# Altium schematic sheet Sh_Outputs_Analog.SchDoc
size A4
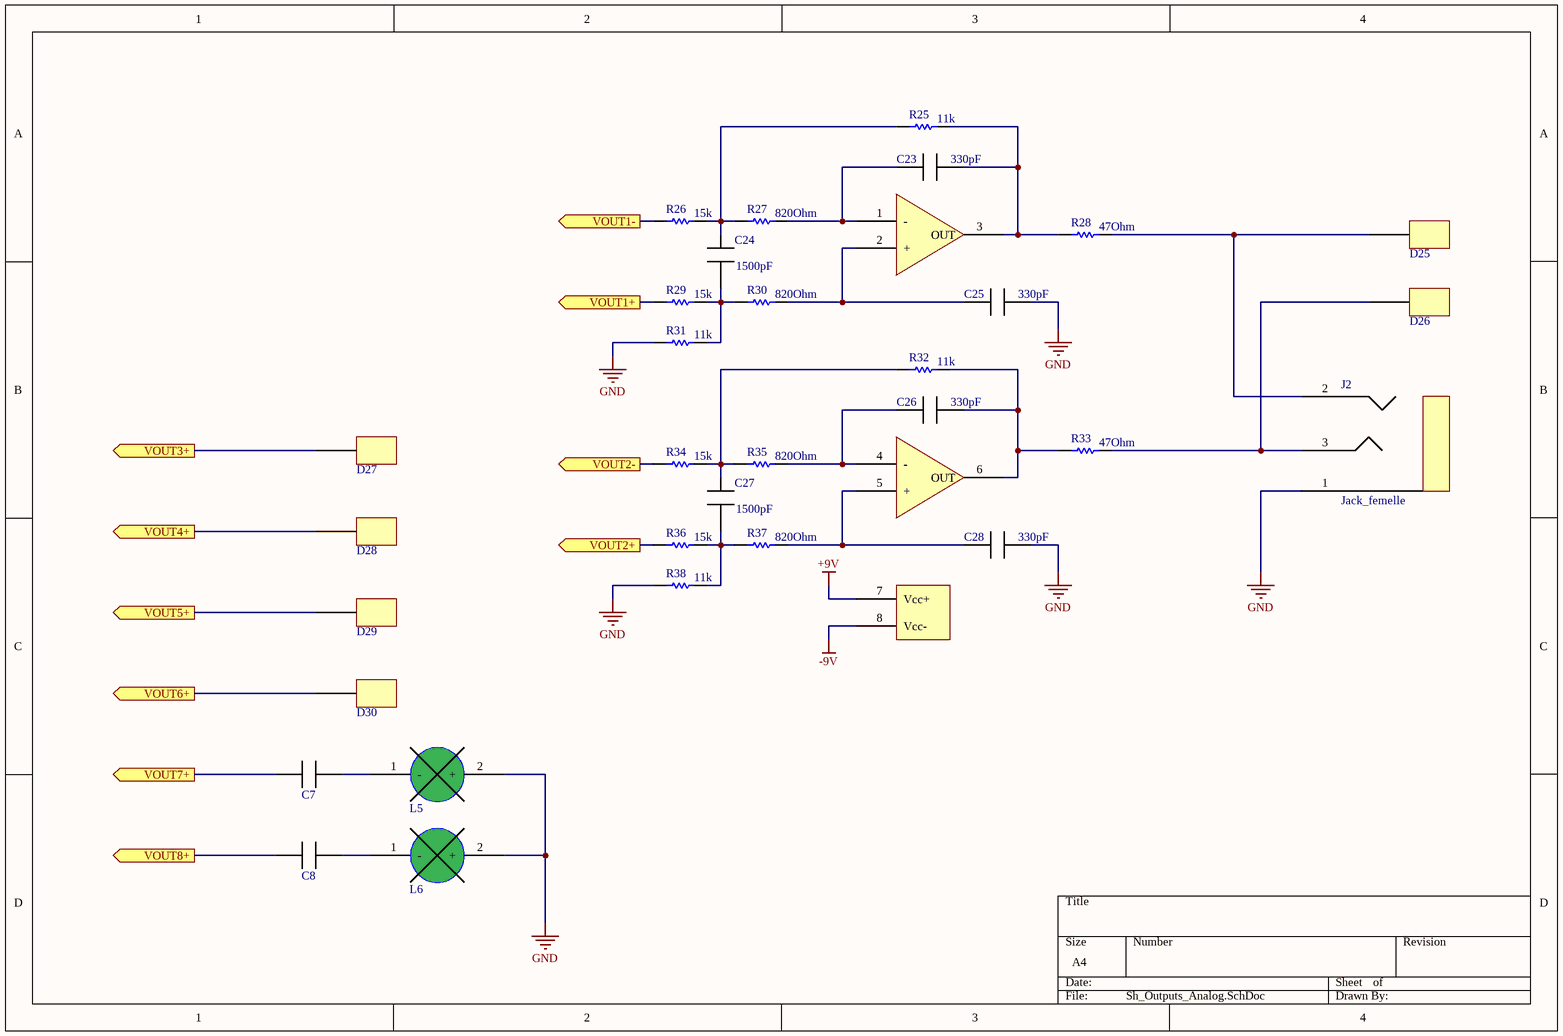
[diagram p0: Sh_Outputs_Analog.SchDoc]

## Parts
C7  Condo  [Condo]  (value not drawn)
C8  Condo  [Condo]  (value not drawn)
C23  330pF  [Condo]
C24  1500pF  [Condo]
C25  330pF  [Condo]
C26  330pF  [Condo]
C27  1500pF  [Condo]
C28  330pF  [Condo]
D25  Pad  [Pad]  (value not drawn)
D26  Pad  [Pad]  (value not drawn)
D27  Pad  [Pad]  (value not drawn)
D28  Pad  [Pad]  (value not drawn)
D29  Pad  [Pad]  (value not drawn)
D30  Pad  [Pad]  (value not drawn)
J2  Jack_femelle  [Jack_Femelle]
L5  Led  [Led]  (value not drawn)
L6  Led  [Led]  (value not drawn)
R25  value 11k  [AXIAL-0.5]  (hidden comment: 10uF)
R26  value 15k  [AXIAL-0.5]  (hidden comment: 10uF)
R27  value 820Ohm  [AXIAL-0.5]  (hidden comment: 10uF)
R28  value 47Ohm  [AXIAL-0.5]  (hidden comment: 10uF)
R29  value 15k  [AXIAL-0.5]  (hidden comment: 10uF)
R30  value 820Ohm  [AXIAL-0.5]  (hidden comment: 10uF)
R31  value 11k  [AXIAL-0.5]  (hidden comment: 10uF)
R32  value 11k  [AXIAL-0.5]  (hidden comment: 10uF)
R33  value 47Ohm  [AXIAL-0.5]  (hidden comment: 10uF)
R34  value 15k  [AXIAL-0.5]  (hidden comment: 10uF)
R35  value 820Ohm  [AXIAL-0.5]  (hidden comment: 10uF)
R36  value 15k  [AXIAL-0.5]  (hidden comment: 10uF)
R37  value 820Ohm  [AXIAL-0.5]  (hidden comment: 10uF)
R38  value 11k  [AXIAL-0.5]  (hidden comment: 10uF)
U6  Ampli_op  (value not drawn)

## Ports
VOUT1+ (out), VOUT1- (out), VOUT2+ (out), VOUT2- (out), VOUT3+ (out), VOUT4+ (out), VOUT5+ (out), VOUT6+ (out), VOUT7+ (out), VOUT8+ (out)

## Nets
+9V: U6.7(Vcc+)
-9V: U6.8(Vcc-)
GND: C25.2(k) C28.2(k) J2.1(GND) L5.2(+) L6.2(+) R31.1 R38.1
VOUT1+: R29.1 ; port VOUT1+
VOUT1-: R26.1 ; port VOUT1-
VOUT2+: R36.1 ; port VOUT2+
VOUT2-: R34.1 ; port VOUT2-
VOUT3+: D27.1 ; port VOUT3+
VOUT4+: D28.1 ; port VOUT4+
VOUT5+: D29.1 ; port VOUT5+
VOUT6+: D30.1 ; port VOUT6+
VOUT7+: C7.1(k) ; port VOUT7+
VOUT8+: C8.1(k) ; port VOUT8+
NetC7_2: C7.2(k) L5.1(-)
NetC8_2: C8.2(k) L6.1(-)
NetC23_1: C23.1(k) R27.2 U6.1(-)
NetC23_2: C23.2(k) R25.2 R28.1 U6.3(OUT)
NetC24_1: C24.1(k) R29.2 R30.1 R31.2
NetC24_2: C24.2(k) R25.1 R26.2 R27.1
NetC25_1: C25.1(k) R30.2 U6.2(+)
NetC26_1: C26.1(k) R35.2 U6.4(-)
NetC26_2: C26.2(k) R32.2 R33.1 U6.6(OUT)
NetC27_1: C27.1(k) R36.2 R37.1 R38.2
NetC27_2: C27.2(k) R32.1 R34.2 R35.1
NetC28_1: C28.1(k) R37.2 U6.5(+)
NetD25_1: D25.1 J2.2(L) R28.2
NetD26_1: D26.1 J2.3(R) R33.2

## Library data of the parts
C23-C28 = Condo
R25-R38 = Res Semi: Semiconductor Resistor; Published: 8-Jun-2000; LatestRevisionDate: 17-Jul-2002; LatestRevisionNote: Re-released for DXP Platform.; PackageReference: AXIAL-0.5; Publisher: Altium Limited; PackageDescription: Axial Device, Thru-Hole; 2 Leads; 0.5 in Pin Spacing